# Altium project Data_Transmission_Panel_v2.PrjPcb
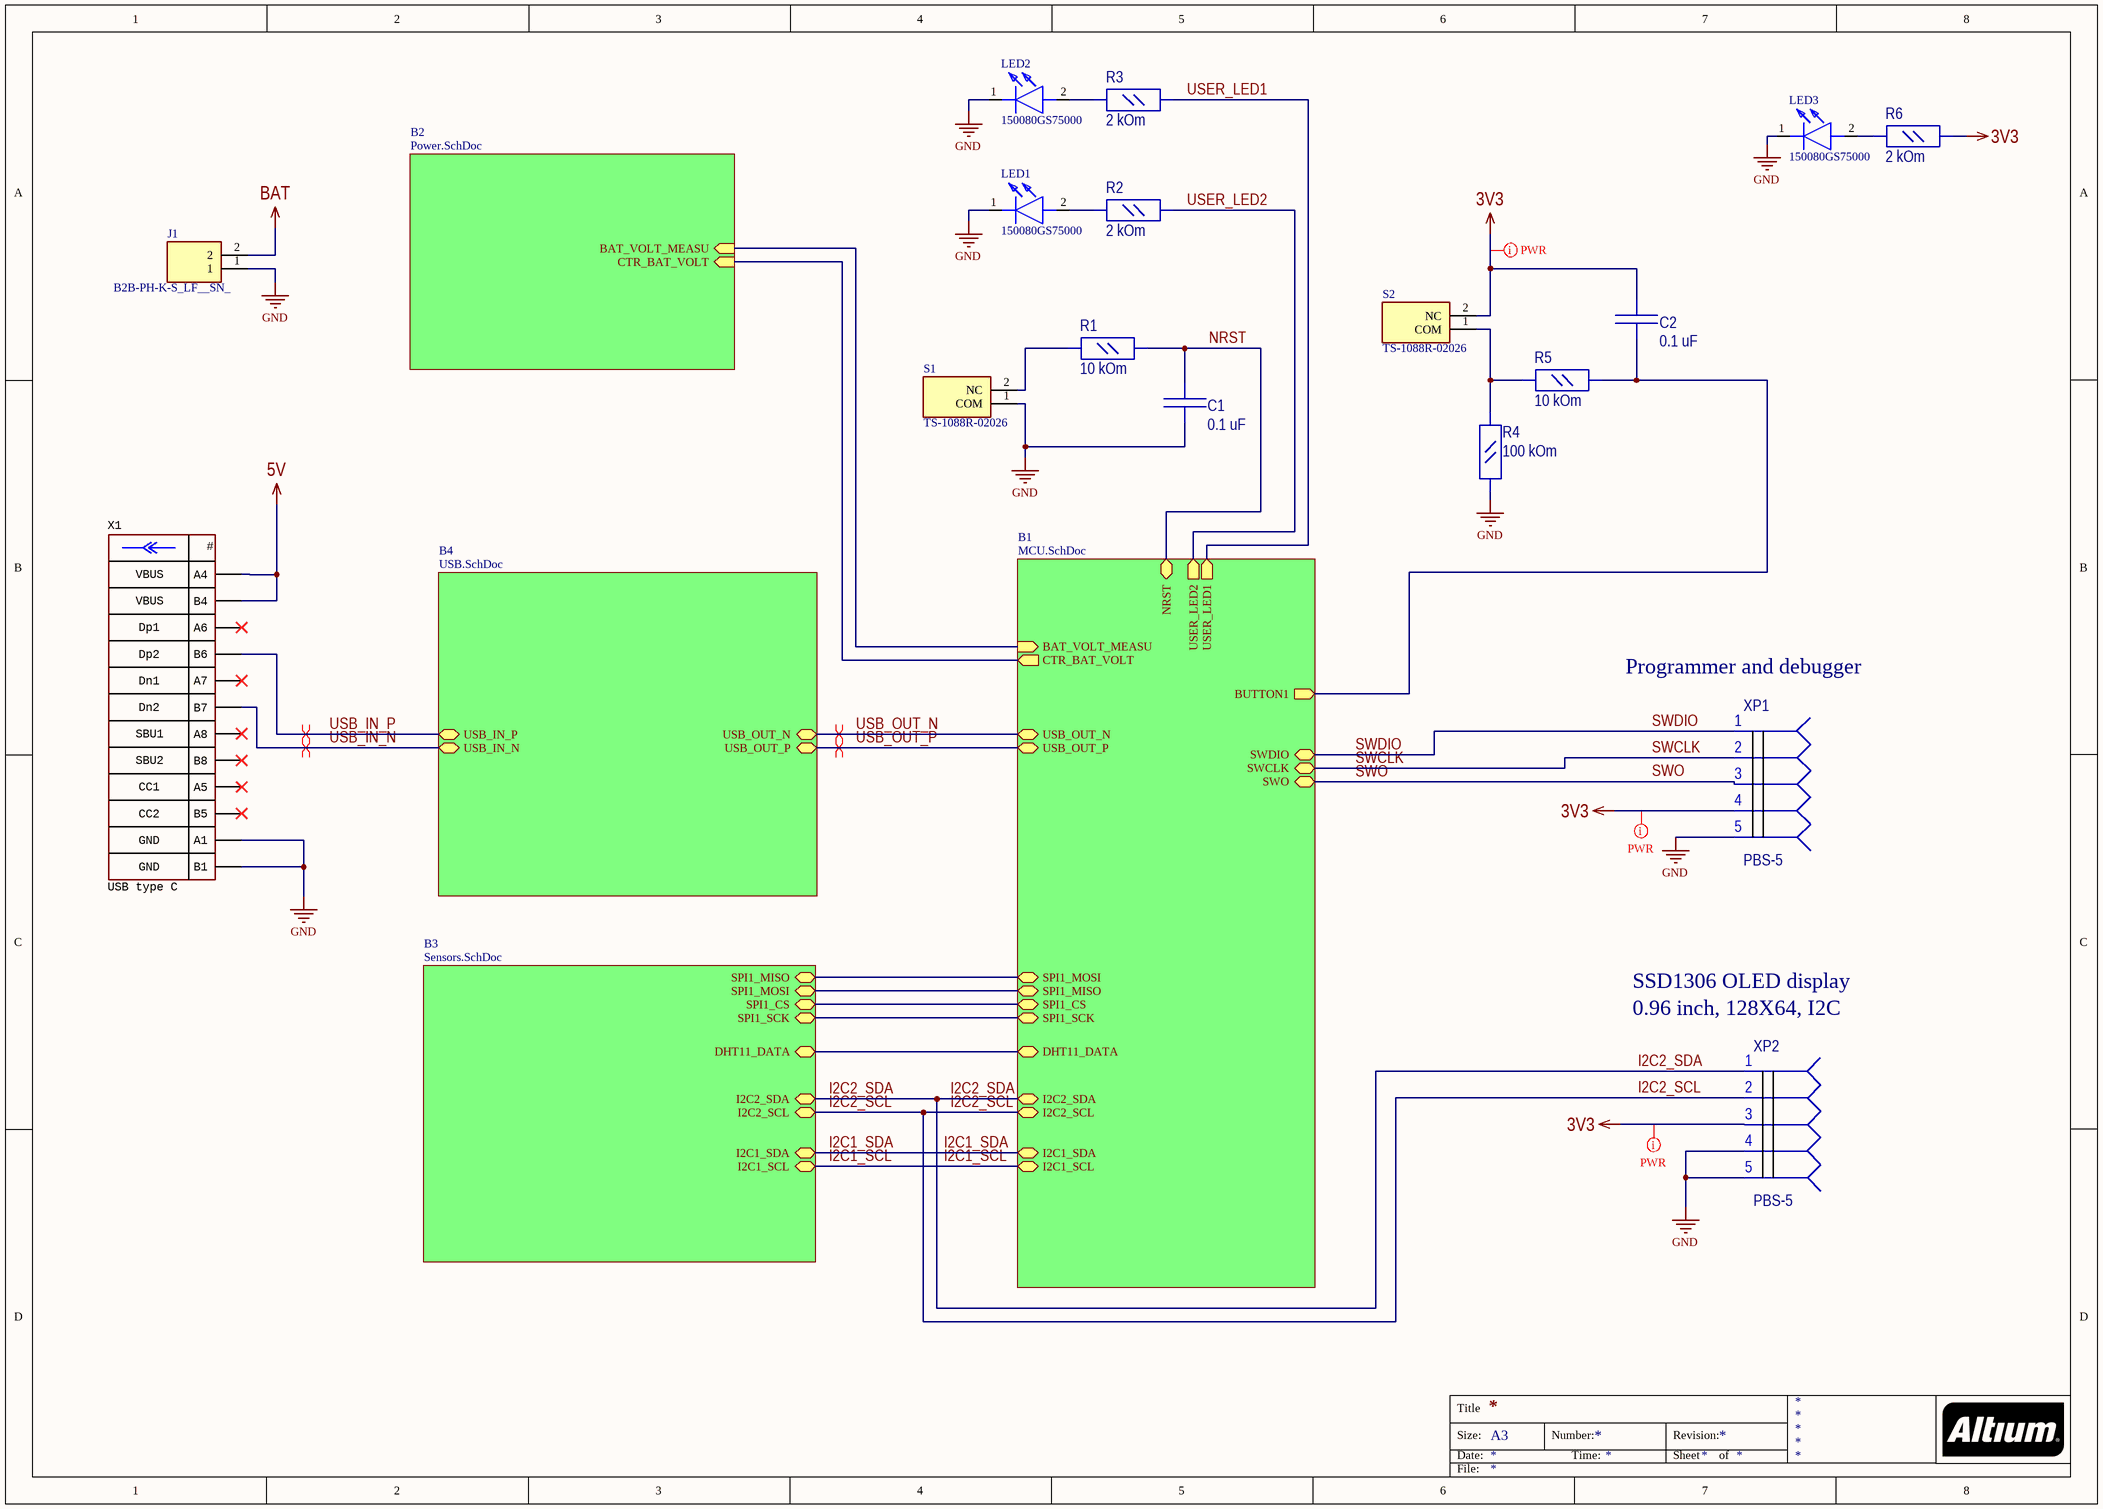
[diagram p0: Main.SchDoc]
5 sheets, 65 parts. Net scope: hierarchical (ports join the sheet entries above them; power ports are global).
Board file: Panel.PcbDoc
Sheets:
  Main.SchDoc
    B1 = MCU.SchDoc
    B2 = Power.SchDoc
    B3 = Sensors.SchDoc
    B4 = USB.SchDoc

## Sheet Main.SchDoc
size A3

### Parts
C1  0.1 uF  [C_0805]
C2  0.1 uF  [C_0805]
J1  B2B-PH-K-S_LF__SN_  [SHDR2W50P0X200_1X2_590X450X600P]
LED1  150080GS75000  [LEDM2012X80N]
LED2  150080GS75000  [LEDM2012X80N]
LED3  150080GS75000  [LEDM2012X80N]
R1  10 kOm  [R_0805]
R2  2 kOm  [R_0805]
R3  2 kOm  [R_0805]
R4  100 kOm  [R_0805]
R5  10 kOm  [R_0805]
R6  2 kOm  [R_0805]
S1  TS-1088R-02026  [TS1088R02026]
S2  TS-1088R-02026  [TS1088R02026]
X1  CommentText: USB type C  [CON: TYPE-C-31-M-12]
XP1  PBS-5  [PBS-5]
XP2  PBS-5  [PBS-5]

### Sub-sheets
B1 = MCU.SchDoc: I2C2_SDA (bidir), SWCLK (bidir), SPI1_SCK (bidir), I2C1_SCL (bidir), BAT_VOLT_MEASU (in), NRST (bidir), SPI1_MOSI (bidir), BUTTON1 (out), SWDIO (bidir), USER_LED2 (out), USER_LED1 (out), SPI1_MISO (bidir), CTR_BAT_VOLT (out), SWO (bidir), I2C2_SCL (bidir), SPI1_CS (bidir), I2C1_SDA (bidir), DHT11_DATA (bidir), USB_OUT_N (bidir), USB_OUT_P (bidir)
B2 = Power.SchDoc: BAT_VOLT_MEASU (in), CTR_BAT_VOLT (in)
B3 = Sensors.SchDoc: I2C1_SCL (bidir), I2C1_SDA (bidir), DHT11_DATA (bidir), I2C2_SCL (bidir), I2C2_SDA (bidir), SPI1_MOSI (bidir), SPI1_SCK (bidir), SPI1_CS (bidir), SPI1_MISO (bidir)
B4 = USB.SchDoc: USB_OUT_N (bidir), USB_OUT_P (bidir), USB_IN_P (bidir), USB_IN_N (bidir)

### Nets
3V3: C2.2 R6.1 S2.2(NC) XP1.4 XP2.3
5V: X1.A4 X1.B4
BAT: J1.2
GND: C1.1 J1.1 LED1.1(K) LED2.1(K) LED3.1(K) R4.2 S1.1(COM) X1.A1 X1.B1 XP1.5 XP2.4 XP2.5
ADC1_IN1: sheet B1/BAT_VOLT_MEASU, sheet B2/BAT_VOLT_MEASU
ADC_UP: sheet B1/CTR_BAT_VOLT, sheet B2/CTR_BAT_VOLT
BUTTON1: C2.1 R5.1 ; sheet B1/BUTTON1
DHT11_DATA: sheet B1/DHT11_DATA, sheet B3/DHT11_DATA
I2C1_SCL: sheet B1/I2C1_SCL, sheet B3/I2C1_SCL
I2C1_SDA: sheet B1/I2C1_SDA, sheet B3/I2C1_SDA
I2C2_SCL: XP2.2 ; sheet B1/I2C2_SCL, sheet B3/I2C2_SCL
I2C2_SDA: XP2.1 ; sheet B1/I2C2_SDA, sheet B3/I2C2_SDA
NRST: C1.2 R1.1 ; sheet B1/NRST
SPI1_CS: sheet B1/SPI1_CS, sheet B3/SPI1_CS
SPI1_MISO: sheet B1/SPI1_MISO, sheet B3/SPI1_MOSI
SPI1_MISO: sheet B1/SPI1_MOSI, sheet B3/SPI1_MISO  [a separate net that carries the same name]
SPI1_SCK: sheet B1/SPI1_SCK, sheet B3/SPI1_SCK
SWCLK: XP1.2 ; sheet B1/SWCLK
SWDIO: XP1.1 ; sheet B1/SWDIO
SWO: XP1.3 ; sheet B1/SWO
USB_IN_N: X1.B7 ; sheet B4/USB_IN_N
USB_IN_P: X1.B6 ; sheet B4/USB_IN_P
USB_OUT_N: sheet B1/USB_OUT_N, sheet B4/USB_OUT_N
USB_OUT_P: sheet B1/USB_OUT_P, sheet B4/USB_OUT_P
USER_LED1: R3.1 ; sheet B1/USER_LED1
USER_LED2: R2.1 ; sheet B1/USER_LED2
NetLED1_2: LED1.2(A) R2.2
NetLED2_2: LED2.2(A) R3.2
NetLED3_2: LED3.2(A) R6.2
NetR1_2: R1.2 S1.2(NC)
NetR4_1: R4.1 R5.2 S2.1(COM)

Not connected (* = marked no-connect by the designer): X1 A5* A6* A7* A8* B5* B8*

### Layout directives
net class PWR: 3V3
differential pair: USB_IN_N, USB_IN_P, USB_OUT_N, USB_OUT_P

### Notes on the sheet
- (near XP1) Programmer and debugger
- SSD1306 OLED display
- (near XP2) 0.96 inch, 128X64, I2C
- Title
- Size:
- Date:
- A3
- Number:
- Time:
- Revision:
- Sheet
- of
- File:
- (in symbol Connector_USB_Type_C) #; VBUS; Dp1; Dp2; Dn1; Dn2; SBU1; SBU2; CC1; CC2; GND

### Library data of the parts
C1 C2 = C_0805: Value: 100nF
J1 = B2B-PH-K-S_LF__SN_: Connector; Manufacturer_Name: JST (JAPAN SOLDERLESS TERMINALS); Manufacturer_Part_Number: B2B-PH-K-S(LF)(SN); Datasheet Link: https://datasheet.lcsc.com/szlcsc/JST-Sales-America-B2B-PH-K-S-LF-SN_C131337.pdf; Height: 6mm; Arrow Part Number: B2B-PH-K-S(LF)(SN); Arrow Price/Stock: https://www.arrow.com/en/products/b2b-ph-k-s-lf-sn/jst-manufacturing
LED1-LED3 = 150080GS75000: LED; Manufacturer_Name: Wurth Elektronik; Datasheet Link: https://katalog.we-online.com/led/datasheet/150080GS75000.pdf; Height: 0.8mm; Manufacturer_Part_Number: 150080GS75000; Mouser Part Number: 710-150080GS75000; Mouser Price/Stock: https://www.mouser.co.uk/ProductDetail/Wurth-Elektronik/150080GS75000?qs=2kOmHSv6VfQRoTEZVk1mGA%3D%3D
R1 R5 R6 = R_0805
  R1 R5: Value: 10 kOm
  R6: Value: 2 kOm
R2 R3 = R_0805: Value: 510 Om
R4 = R_0805: Value: 10 kOm
S1 S2 = TS-1088R-02026: Switch; Manufacturer_Name: XUNPU; Datasheet Link: https://datasheet.lcsc.com/szlcsc/1912111437_XUNPU-TS-1088R-02026_C455280.pdf; Height: 2.2mm; Manufacturer_Part_Number: TS-1088R-02026
X1 = Connector_USB_Type_C: Manufacturer: Korean Hroparts; ValueManufacturerPartNumber: USB Type C, 3A; PartNumber: TYPE-C-31-M-12; CurrentMax: 3A; HelpURL: https://lcsc.com/product-detail/USB-Type-C_Korean-Hroparts-Elec-TYPE-C-31-M-12_C165948.html; TypeConnector: USB Type C

## Sheet MCU.SchDoc
size A4
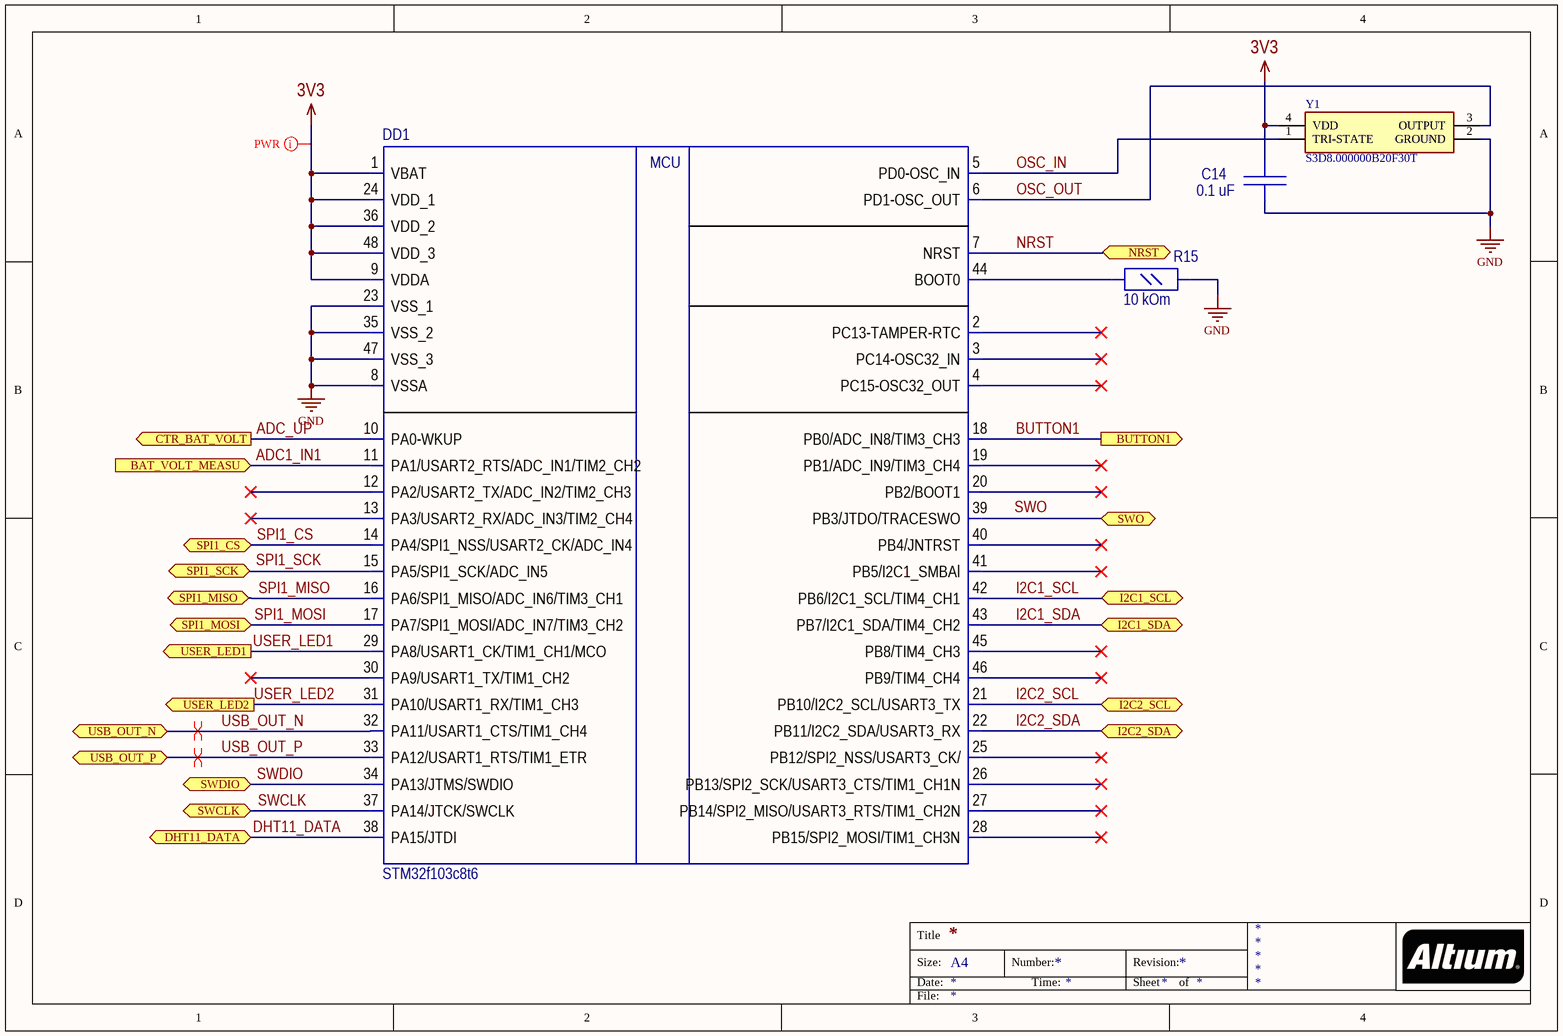
[diagram p1: MCU.SchDoc]

### Parts
C14  0.1 uF  [C_0805]
DD1  STM32f103c8t6  [LQFP48]
R15  10 kOm  [R_0805]
Y1  S3D8.000000B20F30T  [S3D8000000B20F30T]

### Ports
BAT_VOLT_MEASU (in), BUTTON1 (out), CTR_BAT_VOLT (out), DHT11_DATA (bidir), I2C1_SCL (bidir), I2C1_SDA (bidir), I2C2_SCL (bidir), I2C2_SDA (bidir), NRST (bidir), SPI1_CS (bidir), SPI1_MISO (bidir), SPI1_MOSI (bidir), SPI1_SCK (bidir), SWCLK (bidir), SWDIO (bidir), SWO (bidir), USB_OUT_N (bidir), USB_OUT_P (bidir), USER_LED1 (out), USER_LED2 (out)

### Nets
3V3: C14.2 DD1.1(VBAT) DD1.9(VDDA) DD1.24(VDD_1) DD1.36(VDD_2) DD1.48(VDD_3) Y1.4(VDD)
GND: C14.1 DD1.8(VSSA) DD1.23(VSS_1) DD1.35(VSS_2) DD1.47(VSS_3) R15.1 Y1.2(GROUND)
ADC1_IN1: DD1.11(PA1/USART2_RTS/ADC_IN1/TIM2_CH2) ; port BAT_VOLT_MEASU
ADC_UP: DD1.10(PA0-WKUP) ; port CTR_BAT_VOLT
BUTTON1: DD1.18(PB0/ADC_IN8/TIM3_CH3) ; port BUTTON1
DHT11_DATA: DD1.38(PA15/JTDI) ; port DHT11_DATA
I2C1_SCL: DD1.42(PB6/I2C1_SCL/TIM4_CH1) ; port I2C1_SCL
I2C1_SDA: DD1.43(PB7/I2C1_SDA/TIM4_CH2) ; port I2C1_SDA
I2C2_SCL: DD1.21(PB10/I2C2_SCL/USART3_TX) ; port I2C2_SCL
I2C2_SDA: DD1.22(PB11/I2C2_SDA/USART3_RX) ; port I2C2_SDA
NRST: DD1.7(NRST) ; port NRST
OSC_IN: DD1.5(PD0-OSC_IN) Y1.1(TRI-STATE)
OSC_OUT: DD1.6(PD1-OSC_OUT) Y1.3(OUTPUT)
SPI1_CS: DD1.14(PA4/SPI1_NSS/USART2_CK/ADC_IN4) ; port SPI1_CS
SPI1_MISO: DD1.16(PA6/SPI1_MISO/ADC_IN6/TIM3_CH1) ; port SPI1_MISO
SPI1_MOSI: DD1.17(PA7/SPI1_MOSI/ADC_IN7/TIM3_CH2) ; port SPI1_MOSI  [project net SPI1_MISO]
SPI1_SCK: DD1.15(PA5/SPI1_SCK/ADC_IN5) ; port SPI1_SCK
SWCLK: DD1.37(PA14/JTCK/SWCLK) ; port SWCLK
SWDIO: DD1.34(PA13/JTMS/SWDIO) ; port SWDIO
SWO: DD1.39(PB3/JTDO/TRACESWO) ; port SWO
USB_OUT_N: DD1.32(PA11/USART1_CTS/TIM1_CH4) ; port USB_OUT_N
USB_OUT_P: DD1.33(PA12/USART1_RTS/TIM1_ETR) ; port USB_OUT_P
USER_LED1: DD1.29(PA8/USART1_CK/TIM1_CH1/MCO) ; port USER_LED1
USER_LED2: DD1.31(PA10/USART1_RX/TIM1_CH3) ; port USER_LED2
NetDD1_44: DD1.44(BOOT0) R15.2

Not connected (* = marked no-connect by the designer): DD1 2(PC13-TAMPER-RTC)* 3(PC14-OSC32_IN)* 4(PC15-OSC32_OUT)* 12(PA2/USART2_TX/ADC_IN2/TIM2_CH3)* 13(PA3/USART2_RX/ADC_IN3/TIM2_CH4)* 19(PB1/ADC_IN9/TIM3_CH4)* 20(PB2/BOOT1)* 25(PB12/SPI2_NSS/USART3_CK/)* 26(PB13/SPI2_SCK/USART3_CTS/TIM1_CH1N)* 27(PB14/SPI2_MISO/USART3_RTS/TIM1_CH2N)* 28(PB15/SPI2_MOSI/TIM1_CH3N)* 30(PA9/USART1_TX/TIM1_CH2)* 40(PB4/JNTRST)* 41(PB5/I2C1_SMBAl)* 45(PB8/TIM4_CH3)* 46(PB9/TIM4_CH4)*

### Layout directives
net class PWR: 3V3
differential pair: USB_OUT_N, USB_OUT_P

### Notes on the sheet
- Labels drawn without touching a wire or pin: SPI1_SCK, SWO
- Title
- Size:
- Date:
- A4
- Number:
- Time:
- Revision:
- Sheet
- of
- File:
- (in symbol STM32f103c8t6) MCU

### Library data of the parts
C14 = C_0805: Value: 1mF
R15 = R_0805: Value: 10 kOm
Y1 = S3D8.000000B20F30T: Crystal or Oscillator; Manufacturer_Name: Shenzhen SCTF Elec; Datasheet Link: https://datasheet.lcsc.com/szlcsc/1904291731_Shenzhen-SCTF-Elec-S3D8-000000B20F30T_C387337.pdf; Height: 1mm; Manufacturer_Part_Number: S3D8.000000B20F30T

## Sheet Power.SchDoc
size A4
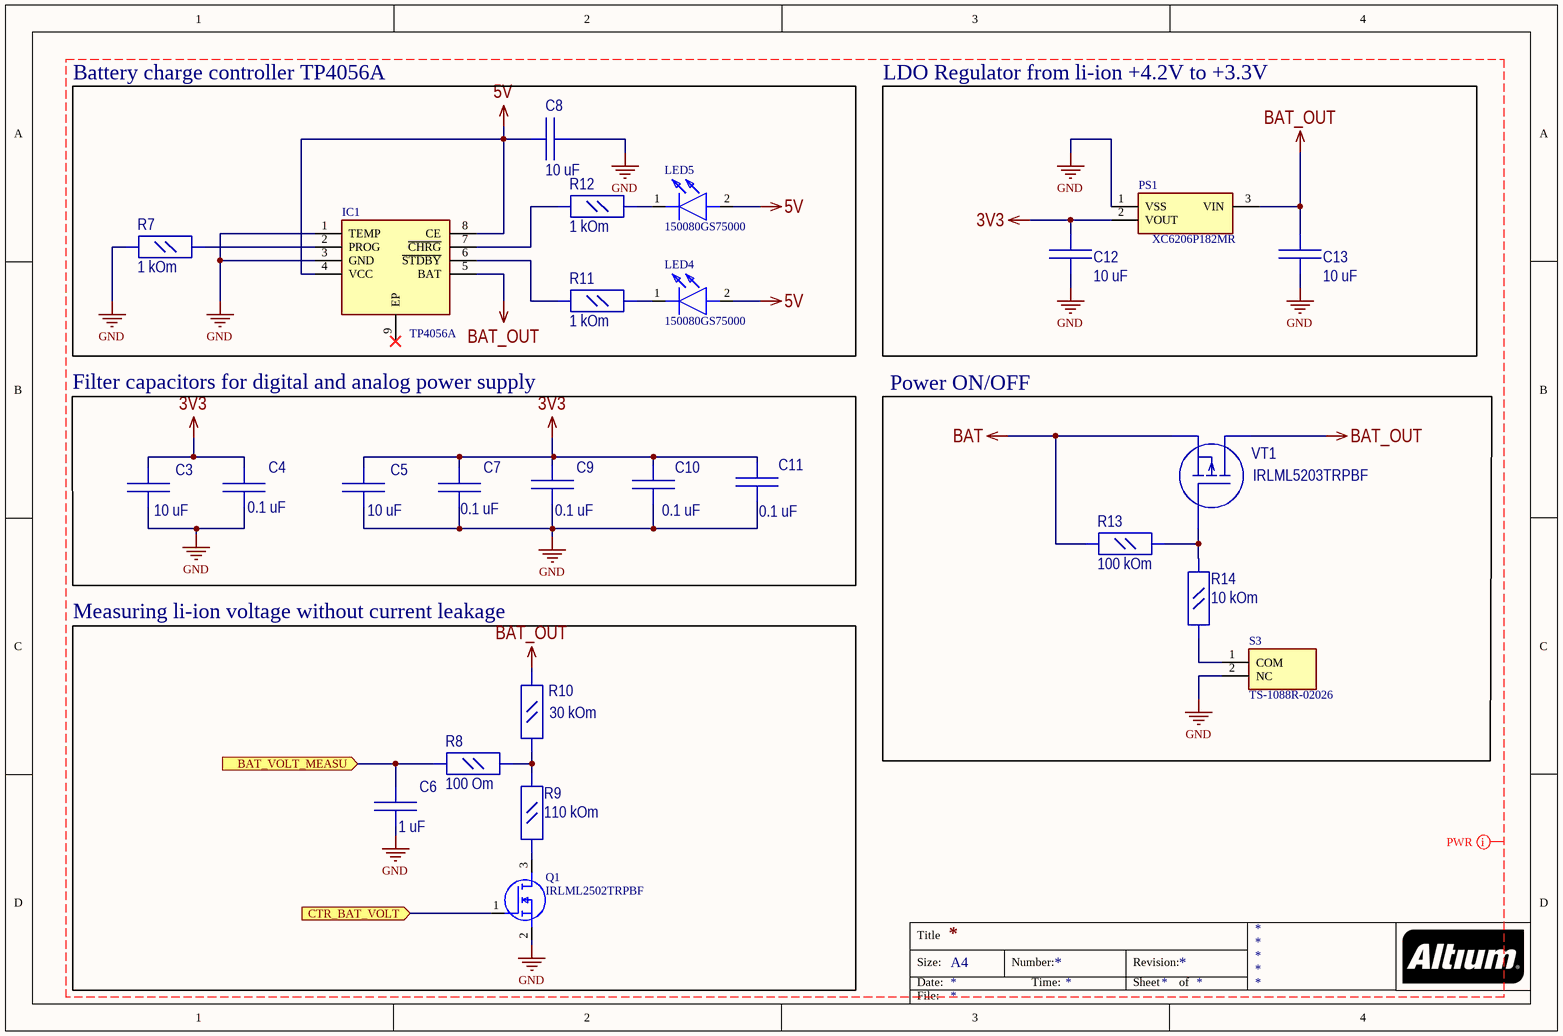
[diagram p2: Power.SchDoc]

### Parts
C3  10 uF  [C_0805]
C4  0.1 uF  [C_0805]
C5  10 uF  [C_0805]
C6  1 uF  [C_0805]
C7  0.1 uF  [C_0805]
C8  10 uF  [C_0805]
C9  0.1 uF  [C_0805]
C10  0.1 uF  [C_0805]
C11  0.1 uF  [C_0805]
C12  10 uF  [C_0805]
C13  10 uF  [C_0805]
IC1  TP4056A  [SOIC127P600X175-9N]
LED4  150080GS75000  [LEDM2012X80N]
LED5  150080GS75000  [LEDM2012X80N]
PS1  XC6206P182MR  [SOT95P280X130-3N]
Q1  IRLML2502TRPBF  [SOT95P237X112-3N]
R7  1 kOm  [R_0805]
R8  100 Om  [R_0805]
R9  110 kOm  [R_0805]
R10  30 kOm  [R_0805]
R11  1 kOm  [R_0805]
R12  1 kOm  [R_0805]
R13  100 kOm  [R_0805]
R14  10 kOm  [R_0805]
S3  TS-1088R-02026  [TS1088R02026]
VT1  IRLML5203TRPBF  [SOT23]

### Blocks framed on the sheet
Battery charge controller TP4056A: C8 IC1 LED4 LED5 R7 R11 R12
LDO Regulator from li-ion +4.2V to +3.3V: C12 C13 PS1
Filter capacitors for digital and analog power supply: C3-C5 C7 C9-C11
Power ON/OFF: R13 R14 S3 VT1
Measuring li-ion voltage without current leakage: C6 Q1 R8-R10

### Ports
BAT_VOLT_MEASU (in), CTR_BAT_VOLT (in)

### Nets
3V3: C3.2 C4.2 C5.2 C7.2 C9.2 C10.2 C11.2 C12.1 PS1.2(VOUT)
5V: C8.2 IC1.4(VCC) IC1.8(CE) LED4.2(A) LED5.2(A)
BAT: R13.2 VT1.2(S)
BAT_OUT: C13.1 IC1.5(BAT) PS1.3(VIN) R10.2 VT1.3(D)
GND: C3.1 C4.1 C5.1 C6.1 C7.1 C8.1 C9.1 C10.1 C11.1 C12.2 C13.2 IC1.1(TEMP) IC1.3(GND) PS1.1(VSS) Q1.2(S) R7.2 S3.2(NC)
ADC1_IN1: C6.2 R8.2 ; port BAT_VOLT_MEASU
ADC_UP: Q1.1(G) ; port CTR_BAT_VOLT
NetIC1_2: IC1.2(PROG) R7.1
NetIC1_6: IC1.6(~{STDBY}) R11.2
NetIC1_7: IC1.7(~{CHRG}) R12.2
NetLED4_1: LED4.1(K) R11.1
NetLED5_1: LED5.1(K) R12.1
NetQ1_3: Q1.3(D) R9.1
NetR8_1: R8.1 R9.2 R10.1
NetR13_1: R13.1 R14.2 VT1.1(G)
NetR14_1: R14.1 S3.1(COM)

Not connected (* = marked no-connect by the designer): IC1 9(EP)*

### Layout directives
net class PWR: 3V3, 5V, BAT, BAT_OUT, GND

### Notes on the sheet
- Title
- Size:
- Date:
- A4
- Number:
- Time:
- Revision:
- Sheet
- of
- File:

### Library data of the parts
C3 C5 = C_0805: Value: 10mF
C4 C6 C7 C9-C11 = C_0805: Value: 100nF
C8 C12 C13 = C_0805
IC1 = TP4056A: Integrated Circuit; Manufacturer_Name: ams; Datasheet Link: https://www.naylampmechatronics.com/img/cms/Datasheets/TC4056A-AMS.pdf; Height: 1.75mm; Manufacturer_Part_Number: TP4056A
LED4 LED5 = 150080GS75000: LED; Manufacturer_Name: Wurth Elektronik; Datasheet Link: https://katalog.we-online.com/led/datasheet/150080GS75000.pdf; Height: 0.8mm; Manufacturer_Part_Number: 150080GS75000; Mouser Part Number: 710-150080GS75000; Mouser Price/Stock: https://www.mouser.co.uk/ProductDetail/Wurth-Elektronik/150080GS75000?qs=2kOmHSv6VfQRoTEZVk1mGA%3D%3D
PS1 = XC6206P182MR: Power Supply; Manufacturer_Name: Torex; Datasheet Link: https://componentsearchengine.com/Datasheets/2/XC6206P182MR.pdf; Height: 1.3mm; Manufacturer_Part_Number: XC6206P182MR
Q1 = IRLML2502TRPBF: MOSFET (N-Channel); Manufacturer_Name: Infineon; Datasheet Link: http://uk.rs-online.com/web/p/products/1623274; Height: 1.12mm; Manufacturer_Part_Number: IRLML2502TRPBF; Mouser Part Number: 942-IRLML2502TRPBF; Mouser Price/Stock: https://www.mouser.co.uk/ProductDetail/Infineon-IR/IRLML2502TRPBF?qs=9%252BKlkBgLFf37zQw9UlZd%2FQ%3D%3D; Arrow Part Number: IRLML2502TRPBF; Arrow Price/Stock: https://www.arrow.com/en/products/irlml2502trpbf/infineon-technologies-ag?region=nac
R7 R11 R12 R14 = R_0805
  R14: Value: 10 kOm
R8 = R_0805: Value: 47 kOm
R9 R13 = R_0805: Value: 10 kOm
R10 = R_0805: Value: 510 kOm
S3 = TS-1088R-02026: Switch; Manufacturer_Name: XUNPU; Datasheet Link: https://datasheet.lcsc.com/szlcsc/1912111437_XUNPU-TS-1088R-02026_C455280.pdf; Height: 2.2mm; Manufacturer_Part_Number: TS-1088R-02026
VT1 = IRLML5203TRPBF: Транзистор, P-канал 30В 3A logic

## Sheet Sensors.SchDoc
size A4
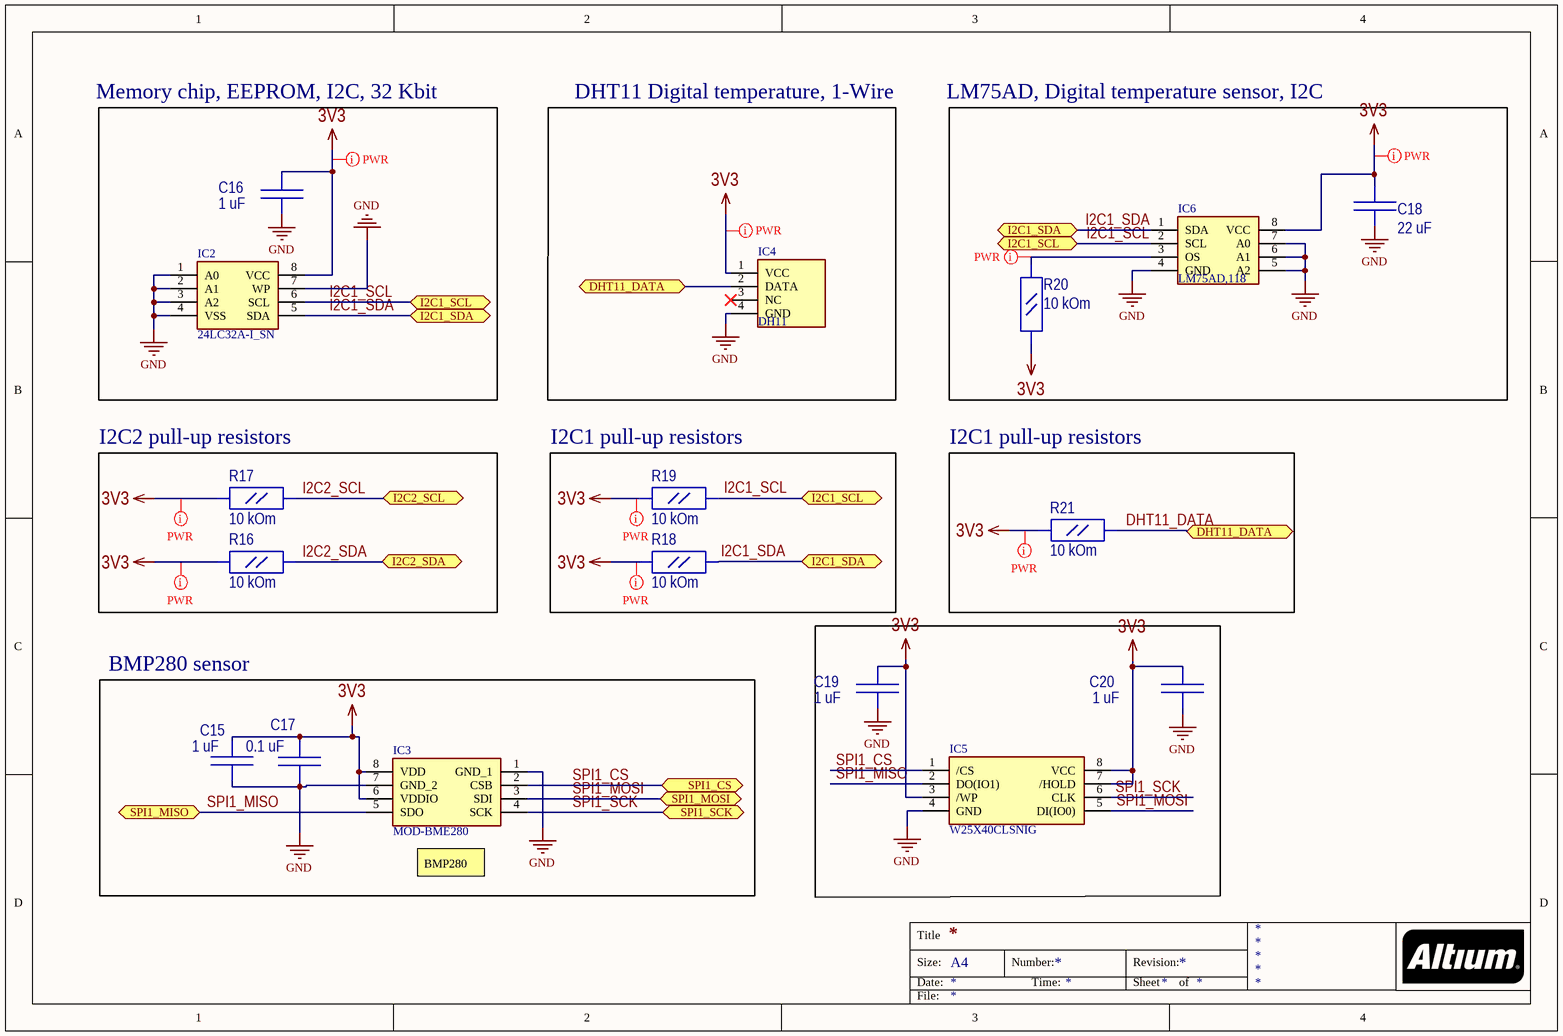
[diagram p3: Sensors.SchDoc]

### Parts
C15  1 uF  [C_0805]
C16  1 uF  [C_0805]
C17  0.1 uF  [C_0805]
C18  22 uF  [C_0805]
C19  1 uF  [C_0805]
C20  1 uF  [C_0805]
IC2  24LC32A-I_SN  [SOIC127P600X175-8N]
IC3  MOD-BME280  [MODBME280]
IC4  DH11  [HDRV4W80P0X254_1X4_1200X500X1550P]
IC5  W25X40CLSNIG  [SOIC127P600X175-8N]
IC6  LM75AD,118  [SOIC127P600X175-8N]
R16  10 kOm  [R_0805]
R17  10 kOm  [R_0805]
R18  10 kOm  [R_0805]
R19  10 kOm  [R_0805]
R20  10 kOm  [R_0805]
R21  10 kOm  [R_0805]

### Blocks framed on the sheet
Memory chip, EEPROM, I2C, 32 Kbit: C16 IC2
DHT11 Digital temperature, 1-Wire: IC4
LM75AD, Digital temperature sensor, I2C: C18 IC6 R20
I2C2 pull-up resistors: R16 R17
I2C1 pull-up resistors: R18 R19
I2C1 pull-up resistors: R21
BMP280 sensor: C15 C17 IC3

### Ports
DHT11_DATA (bidir), I2C1_SCL (bidir), I2C1_SDA (bidir), I2C2_SCL (bidir), I2C2_SDA (bidir), SPI1_CS (bidir), SPI1_MISO (bidir), SPI1_MOSI (bidir), SPI1_SCK (bidir)

### Nets
3V3: C15.2 C16.2 C17.2 C18.2 C19.2 C20.2 IC2.8(VCC) IC3.6(VDDIO) IC3.8(VDD) IC4.1(VCC) IC5.3(/WP) IC5.7(/HOLD) IC5.8(VCC) IC6.8(VCC) R16.1 R17.1 R18.1 R19.1 R20.1 R21.1
GND: C15.1 C16.1 C17.1 C18.1 C19.1 C20.1 IC2.1(A0) IC2.2(A1) IC2.3(A2) IC2.4(VSS) IC2.7(WP) IC3.1(GND_1) IC3.7(GND_2) IC4.4(GND) IC5.4(GND) IC6.4(GND) IC6.5(A2) IC6.6(A1) IC6.7(A0)
DHT11_DATA: IC4.2(DATA) R21.2 ; port DHT11_DATA
I2C1_SCL: IC2.6(SCL) IC6.2(SCL) R19.2 ; port I2C1_SCL
I2C1_SDA: IC2.5(SDA) IC6.1(SDA) R18.2 ; port I2C1_SDA
I2C2_SCL: R17.2 ; port I2C2_SCL
I2C2_SDA: R16.2 ; port I2C2_SDA
SPI1_CS: IC3.2(CSB) IC5.1(/CS) ; port SPI1_CS
SPI1_MISO: IC3.5(SDO) IC5.2(DO(IO1)) ; port SPI1_MISO
SPI1_MOSI: IC3.3(SDI) IC5.5(DI(IO0)) ; port SPI1_MOSI  [project net SPI1_MISO]
SPI1_SCK: IC3.4(SCK) IC5.6(CLK) ; port SPI1_SCK
NetIC6_3: IC6.3(OS) R20.2

Not connected (* = marked no-connect by the designer): IC4 3(NC)*

### Layout directives
net class PWR: 3V3, NetIC6_3

### Notes on the sheet
- (near IC3) BMP280
- Title
- Size:
- Date:
- A4
- Number:
- Time:
- Revision:
- Sheet
- of
- File:

### Library data of the parts
C15-C17 C19 C20 = C_0805: Value: 1mF
C18 = C_0805: Value: 22mF
IC2 = 24LC32A-I_SN: Integrated Circuit; Manufacturer_Name: Microchip; Manufacturer_Part_Number: 24LC32A-I/SN; Datasheet Link: http://ww1.microchip.com/downloads/en/DeviceDoc/21713M.pdf; Height: 1.75mm; Mouser Part Number: 579-24LC32A-I/SN; Mouser Price/Stock: https://www.mouser.co.uk/ProductDetail/Microchip-Technology/24LC32A-I-SN?qs=KwArPi4cUogiVlLk9E3nOw%3D%3D; Arrow Part Number: 24LC32A-I/SN; Arrow Price/Stock: https://www.arrow.com/en/products/24lc32a-isn/microchip-technology
IC3 = MOD-BME280: Integrated Circuit; Manufacturer_Name: Olimex Ltd.; Datasheet Link: https://eu.mouser.com/datasheet/2/306/BME280-1620794.pdf; Height: 1mm; Manufacturer_Part_Number: MOD-BME280; Mouser Part Number: 909-MOD-BME280; Mouser Price/Stock: https://www.mouser.co.uk/ProductDetail/Olimex-Ltd/MOD-BME280?qs=%252B6g0mu59x7K82sEO3yPPgg%3D%3D
IC4 = 101020011: Integrated Circuit; Manufacturer_Name: Seeed Studio; Datasheet Link: https://componentsearchengine.com/Datasheets/1/101020011.pdf; Height: 15.5mm; Manufacturer_Part_Number: 101020011; Mouser Part Number: 713-101020011; Mouser Price/Stock: https://www.mouser.co.uk/ProductDetail/Seeed-Studio/101020011?qs=1%252B9yuXKSi8Dq%252B99bte6U5Q%3D%3D; Arrow Part Number: 101020011; Arrow Price/Stock: https://www.arrow.com/en/products/101020011/seeed-technology-limited
IC5 = W25X40CLSNIG: Integrated Circuit; Manufacturer_Name: Winbond; Datasheet Link: https://www.winbond.com/resource-files/w25x40cl_f 20140325.pdf; Height: 1.75mm; Manufacturer_Part_Number: W25X40CLSNIG; Mouser Part Number: 454-W25X40CLSNIG; Mouser Price/Stock: https://www.mouser.co.uk/ProductDetail/Winbond/W25X40CLSNIG?qs=qSfuJ%252Bfl%2Fd6X%252Bb%2FMViqBBg%3D%3D; Arrow Part Number: W25X40CLSNIG; Arrow Price/Stock: https://www.arrow.com/en/products/w25x40clsnig/winbond-electronics?region=nac
IC6 = LM75AD,118: Integrated Circuit; Manufacturer_Name: NXP; Datasheet Link: http://www.nxp.com/docs/en/data-sheet/LM75A.pdf; Height: 1.75mm; Manufacturer_Part_Number: LM75AD,118; Mouser Part Number: 771-LM75AD-T; Mouser Price/Stock: https://www.mouser.co.uk/ProductDetail/NXP-Semiconductors/LM75AD118?qs=LOCUfHb8d9tvtApDiOTqqg%3D%3D; Arrow Part Number: LM75AD,118; Arrow Price/Stock: https://www.arrow.com/en/products/lm75ad118/nxp-semiconductors?region=nac
R16-R21 = R_0805: Value: 10 kOm

## Sheet USB.SchDoc
size A4
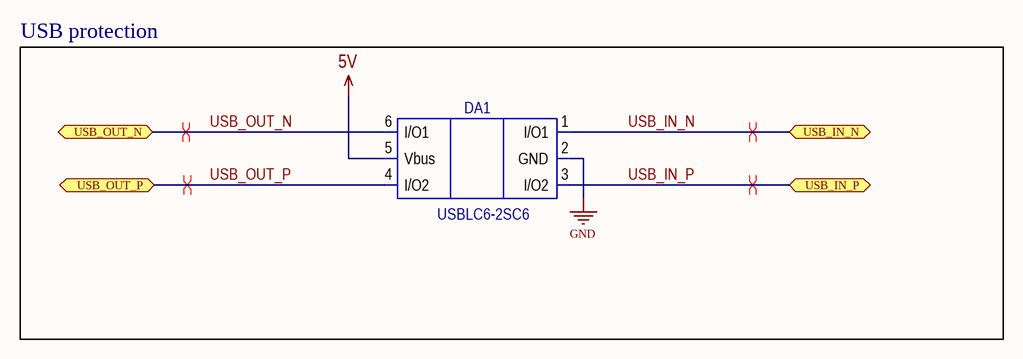
[diagram p4: USB.SchDoc]

### Parts
DA1  USBLC6-2SC6  [SOT-23-6]

### Blocks framed on the sheet
USB protection: DA1

### Ports
USB_IN_N (bidir), USB_IN_P (bidir), USB_OUT_N (bidir), USB_OUT_P (bidir)

### Nets
5V: DA1.5(Vbus)
GND: DA1.2(GND)
USB_IN_N: DA1.1(I/O1) ; port USB_IN_N
USB_IN_P: DA1.3(I/O2) ; port USB_IN_P
USB_OUT_N: DA1.6(I/O1) ; port USB_OUT_N
USB_OUT_P: DA1.4(I/O2) ; port USB_OUT_P

### Layout directives
differential pair: USB_IN_N, USB_IN_P, USB_OUT_N, USB_OUT_P

### Notes on the sheet
- Title
- Size:
- Date:
- A4
- Number:
- Time:
- Revision:
- Sheet
- of
- File:

### Library data of the parts
DA1 = USBLC6-2SC6: HelpURL: https://static.chipdip.ru/lib/093/DOC001093117.pdf

## Nets that join several sheets
3V3: Main (5 pins), MCU (7 pins), Power (9 pins), Sensors (20 pins)
5V: Main (X1.A4 X1.B4), Power (5 pins), USB (DA1.5)
BAT: Main (J1.2), Power (R13.2 VT1.2)
GND: Main (12 pins), MCU (7 pins), Power (17 pins), Sensors (19 pins), USB (DA1.2)
ADC1_IN1: MCU (DD1.11), Power (C6.2 R8.2)
ADC_UP: MCU (DD1.10), Power (Q1.1)
BUTTON1: Main (C2.1 R5.1), MCU (DD1.18)
DHT11_DATA: MCU (DD1.38), Sensors (IC4.2 R21.2)
I2C1_SCL: MCU (DD1.42), Sensors (IC2.6 IC6.2 R19.2)
I2C1_SDA: MCU (DD1.43), Sensors (IC2.5 IC6.1 R18.2)
I2C2_SCL: Main (XP2.2), MCU (DD1.21), Sensors (R17.2)
I2C2_SDA: Main (XP2.1), MCU (DD1.22), Sensors (R16.2)
NRST: Main (C1.2 R1.1), MCU (DD1.7)
SPI1_CS: MCU (DD1.14), Sensors (IC3.2 IC5.1)
SPI1_MISO: MCU (DD1.16), Sensors (IC3.3 IC5.5)
SPI1_MISO: MCU (DD1.17), Sensors (IC3.5 IC5.2)
SPI1_SCK: MCU (DD1.15), Sensors (IC3.4 IC5.6)
SWCLK: Main (XP1.2), MCU (DD1.37)
SWDIO: Main (XP1.1), MCU (DD1.34)
SWO: Main (XP1.3), MCU (DD1.39)
USB_IN_N: Main (X1.B7), USB (DA1.1)
USB_IN_P: Main (X1.B6), USB (DA1.3)
USB_OUT_N: MCU (DD1.32), USB (DA1.6)
USB_OUT_P: MCU (DD1.33), USB (DA1.4)
USER_LED1: Main (R3.1), MCU (DD1.29)
USER_LED2: Main (R2.1), MCU (DD1.31)